# EAGLE design HDMI (EAGLE 6.6.0)
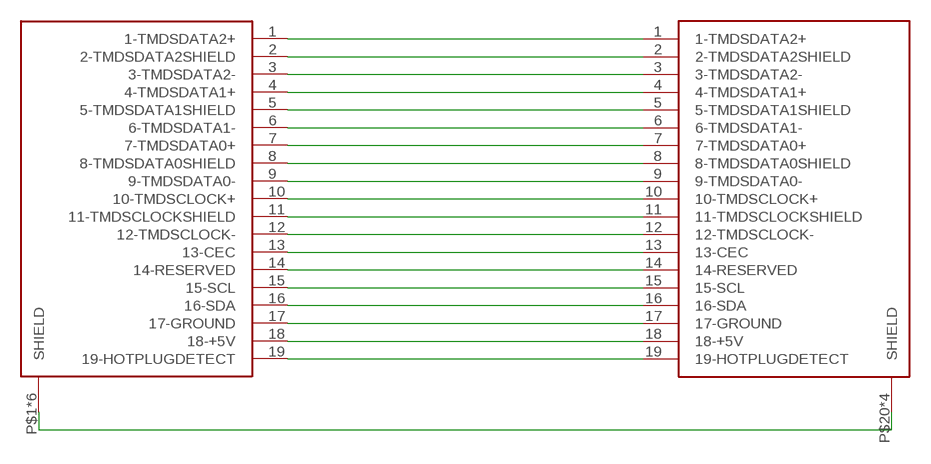
[diagram p0: schematic, sheet 1]

## Parts
U$1  HD03-19-P-FR  [HD03-19-P-FR]
U$2  46770  [46770]

## Nets
0+: U$1.7(7-TMDSDATA0+) U$2.7(7-TMDSDATA0+)
0-: U$1.9(9-TMDSDATA0-) U$2.9(9-TMDSDATA0-)
0S: U$1.8(8-TMDSDATA0SHIELD) U$2.8(8-TMDSDATA0SHIELD)
1+: U$1.4(4-TMDSDATA1+) U$2.4(4-TMDSDATA1+)
1-: U$1.6(6-TMDSDATA1-) U$2.6(6-TMDSDATA1-)
1S: U$1.5(5-TMDSDATA1SHIELD) U$2.5(5-TMDSDATA1SHIELD)
2+: U$1.1(1-TMDSDATA2+) U$2.1(1-TMDSDATA2+)
2-: U$1.3(3-TMDSDATA2-) U$2.3(3-TMDSDATA2-)
2S: U$1.2(2-TMDSDATA2SHIELD) U$2.2(2-TMDSDATA2SHIELD)
5V: U$1.18(18-+5V) U$2.18(18-+5V)
C+: U$1.10(10-TMDSCLOCK+) U$2.10(10-TMDSCLOCK+)
C-: U$1.12(12-TMDSCLOCK-) U$2.12(12-TMDSCLOCK-)
CEC: U$1.13(13-CEC) U$2.13(13-CEC)
CS: U$1.11(11-TMDSCLOCKSHIELD) U$2.11(11-TMDSCLOCKSHIELD)
DETECT: U$1.19(19-HOTPLUGDETECT) U$2.19(19-HOTPLUGDETECT)
GND: U$1.17(17-GROUND) U$2.17(17-GROUND)
RESERVED: U$1.14(14-RESERVED) U$2.14(14-RESERVED)
SCL: U$1.15(15-SCL) U$2.15(15-SCL)
SDA: U$1.16(16-SDA) U$2.16(16-SDA)
SHIELD: U$1.P$20(SHIELD) U$1.P$21(SHIELD) U$1.P$22(SHIELD) U$1.P$23(SHIELD) U$2.P$1(SHIELD) U$2.P$2(SHIELD) U$2.P$3(SHIELD) U$2.P$4(SHIELD) U$2.P$5(SHIELD) U$2.P$6(SHIELD)

## Library data of the parts
U$1 = HDMI:HD03-19-P-FR
U$2 = HDMI:46770

## Board
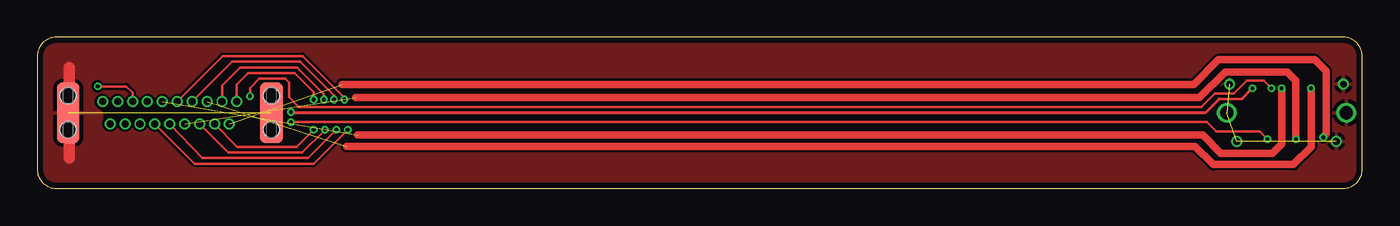
[diagram p1: board, top side]
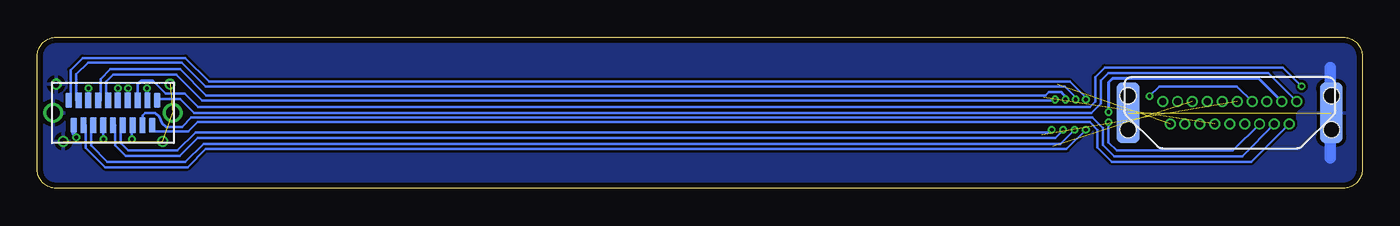
[diagram p2: board, bottom side, seen from below]

Size 88.9 x 10.16 mm. Coordinates in mm from the lower left corner, seen from the top.
Outline: 0,8.89 0,1.27 arc90 1.27,0 87.63,0 arc90 88.9,1.27 88.9,8.89 arc90 87.63,10.16 1.27,10.16 arc90 0,8.89
Copper layers (1*16): Top 0.035mm / dielectric 1.5mm / Bottom 0.035mm
Design rules "default *": minimum track width 6mil, minimum drill 10mil, track to track 6mil, track to pad 6mil, pad to pad 6mil, via to via 6mil, smd to smd 6mil, copper to edge 15mil, drill to drill 8mil, minimum pad ring 5mil, minimum via ring 5mil, stop-mask expansion 1mil, vias tented up to drill 12mil, thermal gap 10mil

### Footprints (pad centres in the part's own frame; a part is rotated, then mirrored left to right if it is on the bottom)
HD03-19-P-FR = drill 0.47 pad 0.737: 1 -4.5,0.75; 2 -4,-0.75; 3 -3.5,0.75; 4 -3,-0.75; 5 -2.5,0.75; 6 -2,-0.75; 7 -1.5,0.75; 8 -1,-0.75; 9 -0.5,0.75; 10 0,-0.75; 11 0.5,0.75; 12 1,-0.75; 13 1.5,0.75; 14 2,-0.75; 15 2.5,0.75; 16 3,-0.75; 17 3.5,0.75; 18 4,-0.75; 19 4.5,0.75 | smd 1.524 x 4.064: P$20 -6.815,0; P$21 6.815,0 | smd 1.524 x 4.064 bottom: P$22 -6.815,0; P$23 6.815,0 | hole 1.067: -6.833,1.143; -6.833,-1.143; 6.833,1.143; 6.833,-1.143
46770 = smd 0.44 x 1: 1 -2.97,0.835; 2 -2.64,-0.835; 3 -2.31,0.835; 4 -1.98,-0.835; 5 -1.65,0.835; 6 -1.32,-0.835; 7 -0.99,0.835; 8 -0.66,-0.835; 9 -0.33,0.835; 10 0,-0.835; 11 0.33,0.835; 12 0.66,-0.835; 13 0.99,0.835; 14 1.32,-0.835; 15 1.65,0.835; 16 1.98,-0.835; 17 2.31,0.835; 18 2.64,-0.835; 19 2.97,0.835 | drill 0.889 pad 1.168: P$1 -4.013,0; P$2 4.013,0 | drill 0.457 pad 0.737: P$3 -3.823,1.918; P$4 3.823,1.918; P$5 -3.327,-1.918; P$6 3.327,-1.918

### Placement (x,y rotation side)
U$1  8.89,5.08 0 bottom
U$2  83.82,5.08 0 bottom

### Tracks (layer width: path | path; a pad name or v marks a point on that pad's centre or on a via)
0+  (via drill 0.25)
  Top 0.152: U$1.7 13.07,8.51 17.63,8.51 19.91,6.22 v19.91,5.97
  Bottom 0.152: v19.91,5.97 19.91,6.15 20.19,6.48 21.03,6.48 21.26,6.25 77.57,6.25 79.32,8 84,8 84.66,7.34 84.66,5.92 U$2.7
0-  (via drill 0.25)
  Top 0.152: U$1.9 12.45,8.89 17.8,8.89 20.6,6.1 v20.6,5.97
  Bottom 0.152: v20.6,5.97 20.5,5.92 77.85,5.92 79.58,7.64 83.82,7.64 84.28,7.19 84.28,5.92 U$2.9
0S  (via drill 0.25)  (1 unrouted)
  Top 0.508: v84.45,3.3 84.45,7.24 83.87,7.82 79.7,7.82 77.98,6.1 21.36,6.1
  Bottom 0.152: U$2.8 84.48,3.33 v84.45,3.3
1+  (via drill 0.25)
  Top 0.152: U$1.4 13.43,2.79 17.4,2.79 v18.54,3.94
  Bottom 0.152: v18.54,3.94 19.84,2.64 77.6,2.64 78.82,1.42 84.35,1.42 85.65,2.72 85.65,4.25 U$2.4
1-  (via drill 0.25)
  Top 0.152: U$1.6 12.81,2.41 17.78,2.41 v19.3,3.94
  Bottom 0.152: v19.3,3.94 20.24,3 77.75,3 78.97,1.78 84.2,1.78 85.29,2.87 85.29,4.25 U$2.6
1S  (via drill 0.25)  (1 unrouted)
  Top 0.508: v85.47,6.73 85.47,2.79 84.28,1.6 78.89,1.6 77.67,2.82 20.75,2.82
  Bottom 0.152: U$2.5 v85.47,6.73
2+  (via drill 0.25)
  Top 0.152: 13.39,6.2 U$1.1 13.39,6.99 14.15,7.75 17.27,7.75 18.54,6.48 v18.54,5.97
  Bottom 0.152: v18.54,5.97 18.54,6.1 19.61,7.16 77.37,7.16 78.97,8.76 85.85,8.76 86.66,7.95 86.66,5.92 U$2.1
2-  (via drill 0.25)
  Top 0.152: v19.23,5.97 19.23,6.35 17.45,8.13 13.61,8.13 12.39,6.9 U$1.3
  Bottom 0.152: v19.23,5.97 19.23,6.1 19.96,6.83 77.6,6.83 79.22,8.46 85.5,8.46 86.28,7.67 86.28,5.92 U$2.3
2S  (via drill 0.25)  (1 unrouted)
  Top 0.508: v86.28,3.43 86.49,3.68 86.49,7.87 85.72,8.64 79.25,8.64 77.6,6.99 20.45,6.99
  Bottom 0.254: U$2.2 86.46,3.66 v86.28,3.43
5V
  Bottom 0.152: U$1.18 7.44,1.78 16.82,1.78 17.78,2.74 17.78,3.94 18.29,4.45 78.13,4.45 78.77,3.81 81.18,3.81 U$2.18
C+  (via drill 0.25)
  Top 0.152: U$1.10 11.06,2.03 18.16,2.03 v20.07,3.94
  Bottom 0.152: v20.07,3.94 20.6,3.4 78.13,3.4 79.35,2.18 82.96,2.18 83.67,2.9 83.67,4.25 U$2.10
C-  (via drill 0.25)
  Top 0.152: U$1.12 10.57,1.65 18.54,1.65 v20.83,3.94
  Bottom 0.152: U$2.12 83.31,4.25 83.31,3.05 82.8,2.54 79.5,2.54 78.28,3.76 21.01,3.76 v20.83,3.94
CEC  (via drill 0.25)
  Top 0.152: v82.8,6.73 82.3,7.24 81.15,7.24 80.29,6.38 79.02,6.38 78.11,5.46 17.55,5.46 16.89,6.12 16.89,7.11 16.64,7.37 14.88,7.37 14.28,6.76 v14.28,6.2
  Bottom 0.152: U$2.13 82.8,5.94 v82.8,6.73 | v14.28,6.2 13.61,6.86 8.42,6.86 U$1.13
CS  (via drill 0.25)  (1 unrouted)
  Top 0.508: v83.49,6.73 83.49,2.97 82.88,2.36 79.43,2.36 78.21,3.58 21.49,3.58
  Bottom 0.152: U$2.11 83.49,6.66 v83.49,6.73
DETECT
  Bottom 0.152: U$1.19 6.31,7.75 17.02,7.75 17.53,7.24 17.53,5.71 18.16,5.08 78.36,5.08 79.3,6.02 80.77,6.02 80.77,5.99 | U$2.19 80.77,5.99 | 80.77,5.99 80.77,5.97
GND  (via drill 0.25)
  Top 0.178: 80.82,6.02 79.3,6.02
  Top 0.203: 80.82,6.02 v81.53,6.73 | 79.3,6.02 78.36,5.08 17.07,5.08 v17.02,5.13
  Bottom 0.152: v81.53,6.73 81.51,6.71
  Bottom 0.203: U$1.17 6.93,7.37 16.76,7.37 17.02,7.11 v17.02,5.13 | 81.51,6.71 U$2.17
N$1
  cutout Top: 4.06,5.71 12.7,5.71 14.48,7.49 16.64,7.49 17.14,6.99 17.14,3.17 16.38,2.41 13.84,2.41 11.94,4.32 4.45,4.32 4.45,5.08 4.06,5.46
N$2
  cutout Top: 77.09,4.06 77.09,5.33 77.98,5.33 80.01,7.37 82.8,7.37 83.19,6.99 83.19,3.17 82.68,2.67 79.5,2.67 78.11,4.06
N$3
  cutout Bottom: 4.06,5.84 6.73,5.84 8,7.11 17.14,7.11 17.78,6.48 17.78,3.3 16.76,2.29 6.73,2.29 4.7,4.32 4.57,4.32 4.45,4.45 4.45,5.08 4.06,5.46
N$4
  cutout Bottom: 76.71,3.68 76.71,5.59 77.6,5.59 79.88,7.87 86.74,7.87 86.74,6.86 87,6.6 87,3.68 86.61,3.3 85.72,3.3 85.47,3.05 85.47,2.67 84.33,1.52 79.5,1.52 77.34,3.68
RESERVED  (via drill 0.25)
  Top 0.152: v82.55,3.3 82.04,3.81 79.12,3.81 78.49,4.45 v17.02,4.45
  Bottom 0.152: U$2.14 82.55,4.2 v82.55,3.3 | U$1.14 8.68,2.54 16.46,2.54 17.02,3.1 v17.02,4.45
SCL  (via drill 0.25)
  Top 0.152: v4.06,6.86 5.97,6.86 6.39,6.44 U$1.15
  Bottom 0.152: U$2.15 82.17,6.98 81.92,7.24 81.15,7.24 80.29,6.38 79.02,6.38 78.11,5.46 18.29,5.46 17.91,5.84 17.91,7.49 17.27,8.13 5.33,8.13 v4.06,6.86
SDA
  Bottom 0.152: U$2.16 81.84,4.9 81.66,5.08 80.97,5.08 80.72,4.83 80.52,4.34 80.26,4.14 79.17,4.14 78.56,4.78 18.11,4.78 17.4,4.06 17.4,2.92 16.64,2.16 8.06,2.16 U$1.16
SHIELD  (5 unrouted)
  Top 0.762: 2.16,8.13 2.16,2.03
  Bottom 0.762: 2.16,2.03 2.16,8.13
  pour Bottom: 0,10.16 88.9,10.16 88.9,0 0,0
  pour Top: 0,10.16 88.9,10.16 88.9,0 0,0